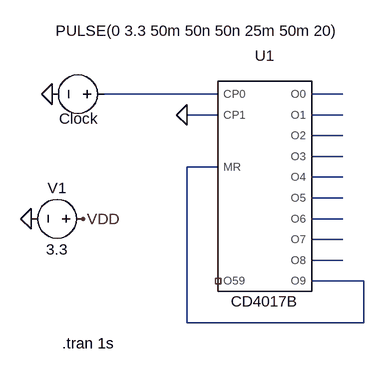
[diagram p0: schematic RingCounter10Bit.asc]
RingCounter10Bit.asc, the LTspice schematic file:
Version 4
SHEET 1 2252 680
WIRE 256 16 80 16
WIRE 448 16 400 16
WIRE 256 48 208 48
WIRE 448 48 400 48
WIRE 448 80 400 80
WIRE 448 112 400 112
WIRE 256 128 208 128
WIRE 448 144 400 144
WIRE 448 176 400 176
WIRE 448 208 400 208
WIRE 448 240 400 240
WIRE 448 272 400 272
WIRE 480 304 400 304
WIRE 208 368 208 128
WIRE 480 368 480 304
WIRE 480 368 208 368
FLAG 0 16 0
FLAG -32 208 0
FLAG 48 208 VDD
FLAG 208 48 0
SYMBOL voltage 64 208 R90
WINDOW 0 -32 56 VBottom 2
WINDOW 3 32 56 VTop 2
SYMATTR InstName V1
SYMATTR Value 3.3
SYMBOL voltage 96 16 R90
WINDOW 0 53 55 VBottom 2
WINDOW 3 -113 -129 VTop 2
SYMATTR InstName Clock
SYMATTR Value PULSE(0 3.3 50m 50n 50n 25m 50m 20)
SYMBOL CD4017B 320 224 R0
SYMATTR InstName U1
TEXT 16 400 Left 2 !.tran 1s

The netlist it stands for:
* RingCounter10Bit.asc
V1 VDD 0 3.3
V§Clock N001 0 PULSE(0 3.3 50m 50n 50n 25m 50m 20)
XU1 N006 0 N001 N002 N003 N004 N005 N007 N008 N009 N010 N011 N006 NC_01 VDD 0 CD4017B VDD=3.3 SPEED=0.1 TRIPDT=1e-9  ; pins MR CP1 CP0 O0 O1 O2 O3 O4 O5 O6 O7 O8 O9 O59
.tran 1s
.lib CD4000_v.lib
.backanno
.end